# EAGLE design spectrum (EAGLE 7.7.0)
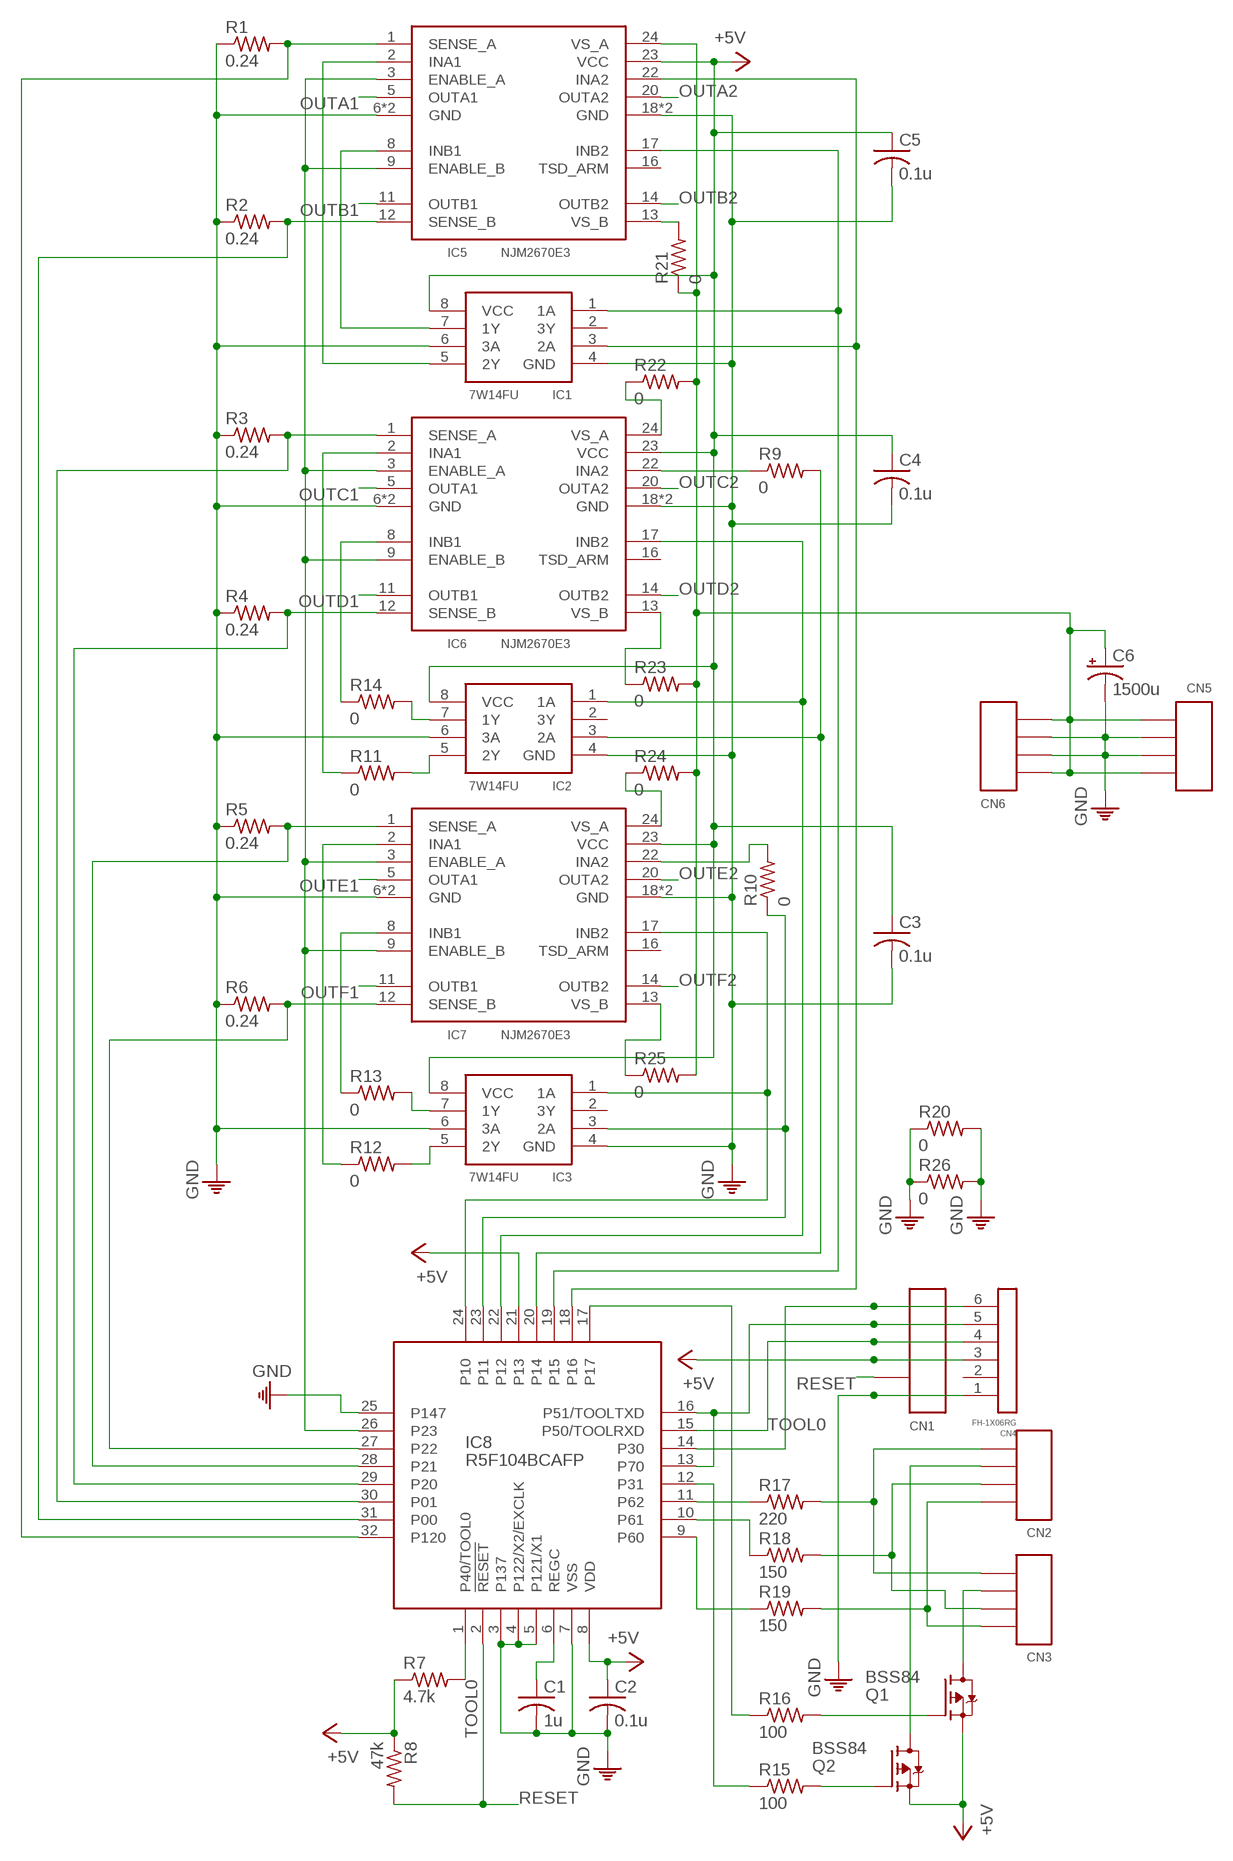
[diagram p0: schematic, sheet 1]

## Parts
C1  1u  C2012  [C2012]
C2  0.1u  C2012  [C2012]
C3  0.1u  C2012  [C2012]
C4  0.1u  C2012  [C2012]
C5  0.1u  C2012  [C2012]
C6  1500u  CCE3.5-8  [E3,5-8]
CN1  PH-1X06RG  [PH-1X06RG]
CN2  PH-1X04SG  [PH-1X04SG]
CN3  PH-1X04SG  [PH-1X04SG]
CN4  FH-1X06RG  [FH-1X06RG]
CN5  PH-1X04SGRG  [PH-1X04RG]
CN6  FH-1X04RG  [FH-1X04RG]
IC1  7W14FU  [SSOP8-P-0.65]
IC2  7W14FU  [SSOP8-P-0.65]
IC3  7W14FU  [SSOP8-P-0.65]
IC5  NJM2670E3  [EMP-24]
IC6  NJM2670E3  [EMP-24]
IC7  NJM2670E3  [EMP-24]
IC8  R5F104BCAFP  [P-LQFP32-7X7-0.80]
Q1  BSS84  [SOT-23F]
Q2  BSS84  [SOT-23F]
R1  0.24  R3225  [R3225]
R2  0.24  R3225  [R3225]
R3  0.24  R3225  [R3225]
R4  0.24  R3225  [R3225]
R5  0.24  R3225  [R3225]
R6  0.24  R3225  [R3225]
R7  4.7k  R2012  [R2012]
R8  47k  R2012  [R2012]
R9  0  R2012  [R2012]
R10  0  R2012  [R2012]
R11  0  R2012  [R2012]
R12  0  R2012  [R2012]
R13  0  R2012  [R2012]
R14  0  R2012  [R2012]
R15  100  R2012  [R2012]
R16  100  R2012  [R2012]
R17  220  R2012  [R2012]
R18  150  R2012  [R2012]
R19  150  R2012  [R2012]
R20  0  R0204/5  [0204/5]
R21  0  R0204/7  [0204/7]
R22  0  R0204/7  [0204/7]
R23  0  R0204/7  [0204/7]
R24  0  R0204/7  [0204/7]
R25  0  R0204/7  [0204/7]
R26  0  R0204/5  [0204/5]

## Nets
+5V: C2.1 C3.1 C4.1 C5.1 CN1.P$4 CN4.3 IC1.8(VCC) IC2.8(VCC) IC3.8(VCC) IC5.23(VCC) IC6.23(VCC) IC7.23(VCC) IC8.8(VDD) IC8.21(P13) Q1.P$2(S) Q2.P$2(S) R7.1 R8.1
GND: C1.2 C2.2 C3.2 C4.2 C5.2 C6.- CN1.P$6 CN4.1 CN5.2 CN5.3 CN6.2 CN6.3 IC1.4(GND) IC1.6(3A) IC2.4(GND) IC2.6(3A) IC3.4(GND) IC3.6(3A) IC5.6(GND) IC5.7(GND) IC5.18(GND) IC5.19(GND) IC6.6(GND) IC6.7(GND) IC6.18(GND) IC6.19(GND) IC7.6(GND) IC7.7(GND) IC7.18(GND) IC7.19(GND) IC8.3(P137) IC8.4(P122/X2/EXCLK) IC8.5(P121/X1) IC8.7(VSS) IC8.25(P147) R1.1 R2.1 R3.1 R4.1 R5.1 R6.1 R20.1 R20.2 R26.1 R26.2
N$1: IC5.1(SENSE_A) IC8.32(P120) R1.2
N$2: IC5.12(SENSE_B) IC8.31(P00) R2.2
N$3: IC1.7(1Y) IC5.8(INB1)
N$4: IC1.1(1A) IC5.17(INB2) IC8.19(P15)
N$5: IC6.1(SENSE_A) IC8.30(P01) R3.2
N$6: IC6.12(SENSE_B) IC8.29(P20) R4.2
N$7: IC6.22(INA2) R9.1
N$8: IC7.12(SENSE_B) IC8.27(P22) R6.2
N$9: IC7.1(SENSE_A) IC8.28(P21) R5.2
N$10: IC5.3(ENABLE_A) IC5.9(ENABLE_B) IC6.3(ENABLE_A) IC6.9(ENABLE_B) IC7.3(ENABLE_A) IC7.9(ENABLE_B) IC8.26(P23)
N$11: IC3.1(1A) IC7.17(INB2) IC8.24(P10)
N$12: IC3.3(2A) IC8.23(P11) R10.1
N$13: C6.+ CN5.1 CN5.4 CN6.1 CN6.4 IC5.24(VS_A) R21.1 R22.2 R23.2 R24.2 R25.2
N$14: IC2.1(1A) IC6.17(INB2) IC8.22(P12)
N$15: IC2.3(2A) IC8.20(P14) R9.2
N$16: IC1.3(2A) IC5.22(INA2) IC8.18(P16)
N$17: IC1.5(2Y) IC5.2(INA1)
N$18: IC7.22(INA2) R10.2
N$19: CN1.P$2 CN4.5 IC8.13(P70) IC8.16(P51/TOOLTXD)
N$20: IC6.8(INB1) R14.1
N$21: IC6.2(INA1) R11.1
N$22: CN1.P$1 CN4.6 IC8.14(P30)
N$23: IC7.8(INB1) R13.1
N$24: IC7.2(INA1) R12.1
N$25: IC2.5(2Y) R11.2
N$26: C1.1 IC8.6(REGC)
N$27: IC3.5(2Y) R12.2
N$28: IC3.7(1Y) R13.2
N$29: IC2.7(1Y) R14.2
N$30: Q2.P$1(G) R15.2
N$31: Q1.P$1(G) R16.2
N$32: IC8.11(P62) R17.1
N$33: CN3.P$2 Q1.P$3(D)
N$34: CN2.P$2 Q2.P$3(D)
N$35: IC8.17 R16.1
N$36: IC8.12(P31) R15.1
N$37: CN2.P$1 CN3.P$1 R17.2
N$38: CN2.P$3 CN3.P$3 R18.2
N$39: CN2.P$4 CN3.P$4 R19.2
N$40: IC8.10(P61) R18.1
N$41: IC8.9(P60) R19.1
N$42: IC5.13(VS_B) R21.2
N$43: IC6.24(VS_A) R22.1
N$45: IC6.13(VS_B) R23.1
N$46: IC7.24(VS_A) R24.1
N$47: IC7.13(VS_B) R25.1
OUTA1: IC5.5(OUTA1)
OUTA2: IC5.20(OUTA2)
OUTB1: IC5.11(OUTB1)
OUTB2: IC5.14(OUTB2)
OUTC1: IC6.5(OUTA1)
OUTC2: IC6.20(OUTA2)
OUTD1: IC6.11(OUTB1)
OUTD2: IC6.14(OUTB2)
OUTE1: IC7.5(OUTA1)
OUTE2: IC7.20(OUTA2)
OUTF1: IC7.11(OUTB1)
OUTF2: IC7.14(OUTB2)
RESET: CN1.P$5 IC8.2(!RESET!) R8.2
TOOL0: CN1.P$3 CN4.4 IC8.1(P40/TOOL0) IC8.15(P50/TOOLRXD) R7.2
Unconnected: CN4.2 IC1.2(3Y) IC2.2(3Y) IC3.2(3Y) IC5.16(TSD_ARM) IC6.16(TSD_ARM) IC7.16(TSD_ARM)

## Library data of the parts
C1-C5 = MyLib:C: CAPACITOR, American symbol
C6 = MyLib:CC: POLARIZED CAPACITOR, American symbol
CN1 = MyLib:PH-1X06
CN2 CN3 CN5 = MyLib:PH-1X04SG
CN4 = MyLib:FH-1X06
CN6 = MyLib:FH-1X04
IC1-IC3 = MyLib:7*14
IC5-IC7 = MyLib:NJM2670
IC8 = MyLib:R5F104B*FP
Q1 Q2 = MyLib:BSS84
R1-R26 = MyLib:R: RESISTOR, American symbol

## Board
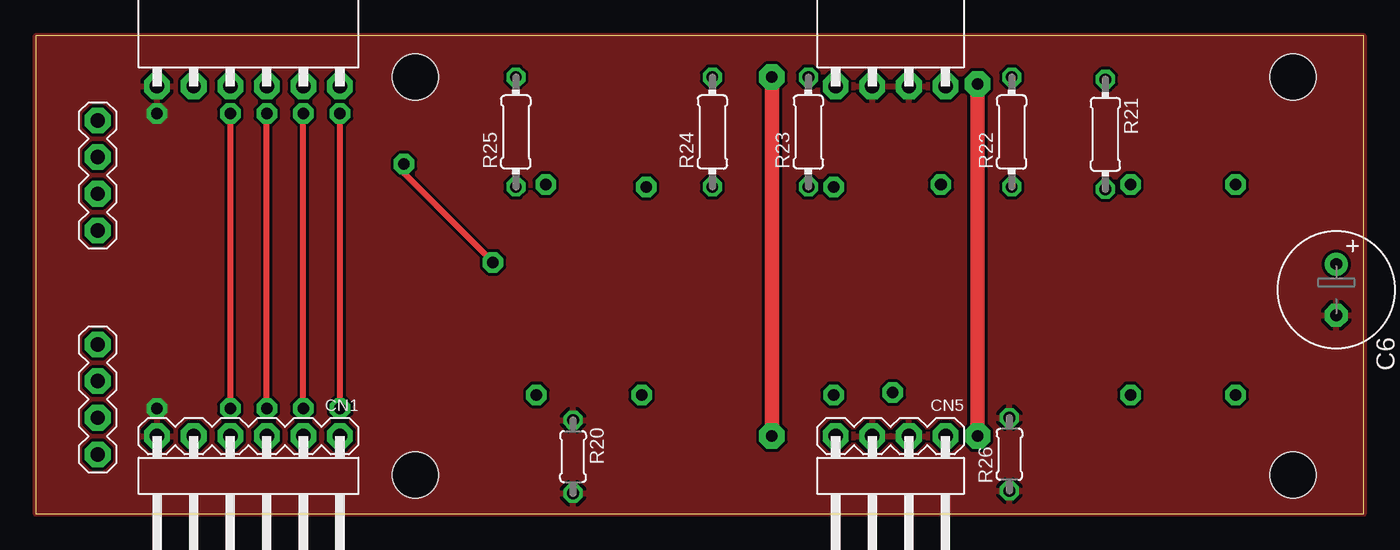
[diagram p1: board, top side]
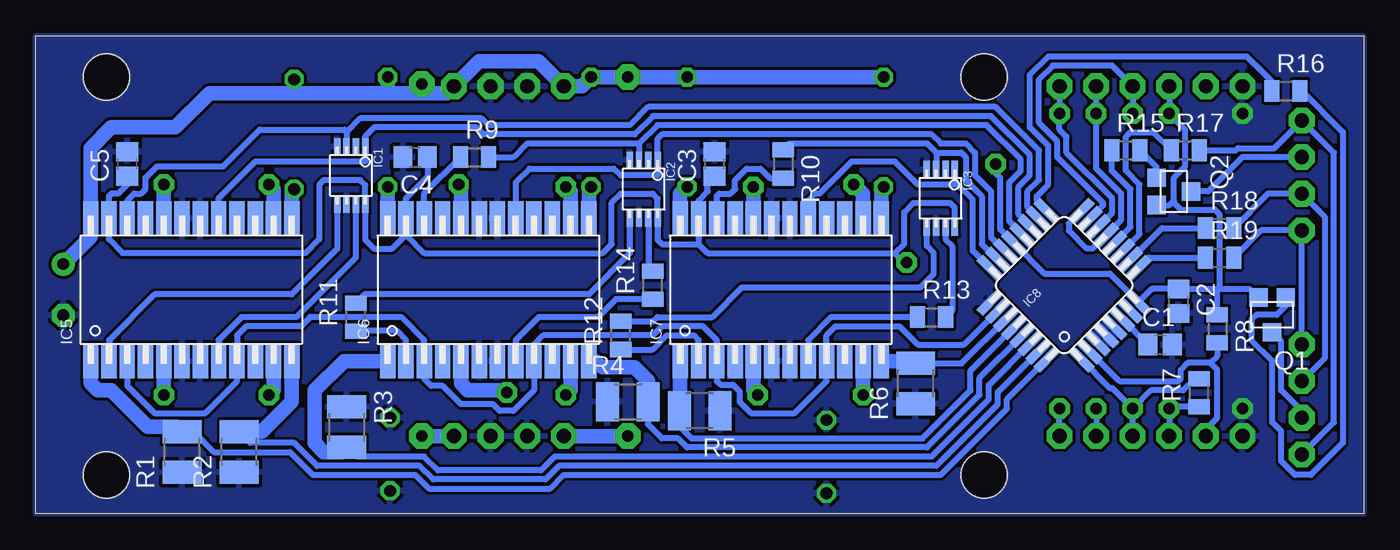
[diagram p2: board, bottom side, seen from below]

Size 92.22 x 33.17 mm. Coordinates in mm from the lower left corner, seen from the top.
Outline: 0,33.17 0,0 92.22,0 92.22,33.17 0,33.17
Copper layers (1*16): Top 0.0356mm / dielectric 1.5011mm / Bottom 0.0356mm
Design rules "formitaminimum *": minimum track width 5mil, minimum drill 0.5994mm, track to track 0.2007mm, track to pad 0.2007mm, pad to pad 0.2007mm, via to via 0.2007mm, smd to smd 0mil, copper to edge 0mil, drill to drill 1mil, minimum pad ring 10mil, minimum via ring 8mil, stop-mask expansion 4mil, vias tented up to drill 0mil, thermal gap 10mil
Holes 3.2 mm at 87.31,30.31 87.31,2.69 26.35,2.69 26.35,30.31

### Footprints (pad centres in the part's own frame; a part is rotated, then mirrored left to right if it is on the bottom)
C2012 = smd 1.3 x 1.5: 1 -0.85,0; 2 0.85,0
E3,5-8 = drill 0.813 pad 1.6: + -1.778,0 | drill 0.813 pad 1.6 octagon: - 1.778,0
PH-1X06RG = drill 1 pad 1.778 octagon: P$1 -6.35,0; P$2 -3.81,0; P$3 -1.27,0; P$4 1.27,0; P$5 3.81,0; P$6 6.35,0
PH-1X04SG = drill 1 pad 1.778 octagon: P$1 -3.81,0; P$2 -1.27,0; P$3 1.27,0; P$4 3.81,0
FH-1X06RG = drill 1 pad 1.778 octagon: 1 -6.35,0; 2 -3.81,0; 3 -1.27,0; 4 1.27,0; 5 3.81,0; 6 6.35,0
PH-1X04RG = drill 1 pad 1.778 octagon: 1 -3.81,0; 2 -1.27,0; 3 1.27,0; 4 3.81,0
FH-1X04RG = drill 1 pad 1.778 octagon: 1 -6.35,0; 2 -3.81,0; 3 -1.27,0; 4 1.27,0
SSOP8-P-0.65 = smd 1.2 x 0.45: 1 -2,0.975; 2 -2,0.325; 3 -2,-0.325; 4 -2,-0.975; 5 2,-0.975; 6 2,-0.325; 7 2,0.325; 8 2,0.975
EMP-24 = smd 2.4 x 1.07: 1 -4.95,6.985; 2 -4.95,5.715; 3 -4.95,4.445; 4 -4.95,3.175; 5 -4.95,1.905; 6 -4.95,0.635; 7 -4.95,-0.635; 8 -4.95,-1.905; 9 -4.95,-3.175; 10 -4.95,-4.445; 11 -4.95,-5.715; 12 -4.95,-6.985; 13 4.95,-6.985; 14 4.95,-5.715; 15 4.95,-4.445; 16 4.95,-3.175; 17 4.95,-1.905; 18 4.95,-0.635; 19 4.95,0.635; 20 4.95,1.905; 21 4.95,3.175; 22 4.95,4.445; 23 4.95,5.715; 24 4.95,6.985
P-LQFP32-7X7-0.80 = smd 0.6 x 2: 1 -2.8,-4.5; 2 -2,-4.5; 3 -1.2,-4.5; 4 -0.4,-4.5; 5 0.4,-4.5; 6 1.2,-4.5; 7 2,-4.5; 8 2.8,-4.5; 17 2.8,4.5; 18 2,4.5; 19 1.2,4.5; 20 0.4,4.5; 21 -0.4,4.5; 22 -1.2,4.5; 23 -2,4.5; 24 -2.8,4.5 | smd 2 x 0.6: 9 4.5,-2.8; 10 4.5,-2; 11 4.5,-1.2; 12 4.5,-0.4; 13 4.5,0.4; 14 4.5,1.2; 15 4.5,2; 16 4.5,2.8; 25 -4.5,2.8; 26 -4.5,2; 27 -4.5,1.2; 28 -4.5,0.4; 29 -4.5,-0.4; 30 -4.5,-1.2; 31 -4.5,-2; 32 -4.5,-2.8
SOT-23F = smd 1.27 x 1.27: P$1 -0.95,-1.2; P$2 0.95,-1.2; P$3 0,1.2
R3225 = smd 1.6 x 2.7: 1 -1.4,0; 2 1.4,0
R2012 = smd 1.046 x 1.5: 1 -0.977,0; 2 0.977,0
0204/5 = drill 0.813 octagon: 1 -2.54,0; 2 2.54,0
0204/7 = drill 0.813 octagon: 1 -3.81,0; 2 3.81,0

### Placement (x,y rotation side)
C1  14.13,11.73 0 bottom
C2  12.86,14.75 270 bottom
C3  45.09,24.28 90 bottom
C4  65.88,24.75 180 bottom
C5  85.88,24.28 90 bottom
C6  90.33,15.54 270 top
CN1  14.76,5.38 180 top
CN2  4.29,23.48 270 top
CN3  4.29,7.92 90 top
CN4  14.76,29.67 0 top
CN5  59.37,5.38 180 top
CN6  61.91,29.67 0 top
IC1  70.33,23.48 270 bottom
IC2  50.01,22.53 270 bottom
IC3  29.37,21.89 270 bottom
IC5  81.44,15.54 90 bottom
IC6  60.8,15.54 90 bottom
IC7  40.48,15.54 90 bottom
IC8  20.8,15.86 45 bottom
Q1  6.35,13.8 180 bottom
Q2  13.18,22.37 270 bottom
R1  82.07,4.27 90 bottom
R2  78.11,4.27 90 bottom
R3  70.64,6.02 270 bottom
R4  51.12,7.77 0 bottom
R5  46.12,7.13 180 bottom
R6  31.12,9.04 90 bottom
R7  11.43,8.4 90 bottom
R8  10.16,12.85 270 bottom
R9  61.75,24.75 0 bottom
R10  40.32,24.28 270 bottom
R11  70.01,13.64 90 bottom
R12  51.59,12.37 90 bottom
R13  30,13.64 0 bottom
R14  49.37,15.86 90 bottom
R15  16.51,25.23 0 bottom
R16  5.4,29.36 0 bottom
R17  12.38,25.23 0 bottom
R18  10,19.83 0 bottom
R19  10,17.77 0 bottom
R20  37.31,3.96 270 top
R21  74.3,26.34 270 top
R22  67.79,26.5 90 top
R23  53.66,26.5 90 top
R24  46.99,26.5 90 top
R25  33.34,26.5 90 top
R26  67.63,4.12 90 top

### Tracks (layer width: path | path; a pad name or v marks a point on that pad's centre or on a via)
+5V  (via drill 0.8 pad 1.42)
  Top 0.406: v13.49,27.77 v13.49,7.29 | v25.56,24.28 25.56,23.64 v31.75,17.45
  Bottom 0.406: 66.52,19.36 IC6.23 66.52,21.89 65.03,23.38 C4.1 | 46.2,18.72 IC7.23 46.2,21.74 45.56,22.37 45.56,22.95 C3.1 | 46.2,18.72 45.56,18.09 32.54,18.09 | 32.54,18.09 31.91,18.72 31.91,20.94 31.27,21.58 28.73,21.58 28.39,21.24 IC3.8 | 66.52,19.36 67.47,18.4 68.74,18.4 69.35,19.02 IC1.8 69.35,22.82 69.69,23.16 72.23,23.16 72.55,22.85 72.55,19.04 73.5,18.09 86.2,18.09 87.15,19.04 IC5.23 87.15,22.05 86.99,22.21 86.52,22.21 85.88,22.85 C5.1 | 66.52,19.36 65.25,18.09 52.86,18.09 52.23,18.72 52.23,21.58 51.59,22.21 49.37,22.21 49.03,21.87 IC2.8 49.03,19.02 48.74,18.72 46.2,18.72 | v25.56,24.28 25.56,23.64 25.24,23.32 25.24,19.74 IC8.21 22.16,16.66 17.63,16.66 IC8.8 14.69,15.6 C2.1 10.16,15.6 | v31.75,17.45 31.91,17.45 32.54,18.09 | CN4.3 v13.49,27.77 12.38,26.66 12.38,24.12 13.18,23.32 13.18,21.74 | CN1.P$4 v13.49,7.29 13.36,7.42 R7.1 | 10.16,15.6 10,15.6 | 10,15.6 7.9,15.6 Q1.P$2 | 13.18,21.74 13.18,21.58 12.7,21.1 10.32,21.1 10,20.78 10,15.6 | Q2.P$2 13.49,21.42 13.18,21.74 | R8.1 10.16,15.6
GND  (via drill 0.8 pad 1.42)
  other vias: 8.41,7.29 8.41,27.77
  pour Bottom: 0,33.17 0,-0.01 92.23,-0.01 92.23,33.17
  pour Top: 0,33.17 92.23,33.17 92.23,-0.01 0,-0.01
N$1
  Bottom 0.406: IC8.32 24.76,7.93 24.76,7.29 29.37,2.69 55.56,2.69 56.51,1.73 64.93,1.73 65.88,2.69 73,2.69 74.58,4.27 79.85,4.27 81.25,5.67 R1.2
  Bottom 1.016: IC5.1 88.42,9.04 87.95,8.56 86.99,8.56 84.45,6.02 82.42,6.02 R1.2
N$2
  Bottom 0.406: IC8.31 25.4,8.43 25.4,7.61 29.69,3.32 55.88,3.32 56.83,2.37 64.61,2.37 65.56,3.32 72.71,3.32 74.29,4.91 77.34,4.91 R2.2
  Bottom 1.016: IC5.12 74.45,7.77 76.55,5.67 R2.2
N$3
  Bottom 0.406: IC1.7 70,17.77 74.14,13.64 77.95,13.64 79.53,12.05 IC5.8
N$4
  Bottom 0.406: IC8.19 23.13,19.94 23.97,20.78 23.97,22.69 23.18,23.48 23.18,24.91 25.88,27.61 49.37,27.61 50.64,26.34 61.12,26.34 61.59,26.82 68.74,26.82 69.35,26.2 IC1.1 69.35,24.46 69.37,24.43 76.99,24.43 79.53,21.89 IC5.17
N$5
  Bottom 0.406: IC8.30 26.03,8.93 26.03,7.92 30,3.96 56.2,3.96 57.15,3 64.29,3 65.25,3.96 69.98,3.96 R3.2
  Bottom 1.016: IC6.1 70.83,10.59 72.87,8.56 72.87,4.91 72.23,4.27 70.99,4.27 R3.2
N$6
  Bottom 0.406: IC8.29 26.67,9.42 26.67,8.24 30.32,4.59 46.99,4.59 47.62,5.23 48.74,5.23 49.72,6.21 R4.2
  Bottom 1.016: IC6.12 53.31,10.59 52.86,10.15 50.64,10.15 49.72,9.22 R4.2
N$7
  Bottom 0.406: IC6.22 65.25,22.24 R9.1
N$8
  Bottom 0.406: R6.2 27.92,10.44 IC8.27
  Bottom 1.016: IC7.12 31.27,10.59 R6.2
N$9
  Bottom 0.406: IC8.28 27.3,9.92 27.3,8.56 30.64,5.23 46.67,5.23 47.52,6.07 R5.2
  Bottom 1.016: IC7.1 47.47,7.18 R5.2
N$10
  Bottom 0.406: IC5.3 85.88,8.88 83.98,6.97 80.49,6.97 78.26,9.2 IC5.9 78.26,12.37 77.63,13 73.82,13 73.18,13.64 66.83,13.64 65.25,12.05 IC6.3 65.25,9.35 64.77,8.88 63.98,8.88 62.71,7.61 60.48,7.61 60.01,7.13 59.05,7.13 57.63,8.56 IC6.9 57.63,11.73 56.99,12.37 49.37,12.37 48.74,13 45.88,13 44.93,12.05 IC7.3 44.93,9.2 44.69,8.96 43.81,8.96 43.34,8.48 43.34,7.77 42.54,6.97 39.53,6.97 37.31,9.2 IC7.9 37.31,12.37 36.67,13 32.23,13 30.96,11.73 27.75,11.73 IC8.26
N$11
  Bottom 0.406: IC3.1 28.39,22.87 | 28.39,22.87 28.42,22.85 30.96,22.85 32.54,24.43 35.56,24.43 37.78,22.21 38.1,22.21 38.58,21.74 IC7.17 | 28.39,22.87 28.23,22.87 27.15,21.78 27.15,18.24 IC8.24
N$12
  Bottom 0.406: 29.69,25.07 29.69,23.9 IC3.3 | 29.69,25.07 30.32,25.7 39.87,25.7 R10.1 | 29.69,25.07 27.94,25.07 27.62,24.75 27.62,23.16 26.51,22.05 26.51,18.72 25.42,17.63 IC8.23
N$13  (via drill 0.8 pad 1.78)
  Top 1.016: v51.12,5.39 v51.12,30.31 | v65.4,5.39 v65.4,29.83
  Bottom 1.016: 74.29,29.2 80.17,29.2 82.55,26.82 86.99,26.82 88.42,25.39 IC5.24 88.42,19.23 C6.+ | 74.29,29.2 67.63,29.2 | 67.63,29.2 65.4,29.2 | 65.4,29.2 63.66,29.2 CN6.4 61.44,31.42 57.31,31.42 CN6.1 54.29,29.67 R23.2 v51.12,30.31 R24.2 R25.2 | R21.1 74.29,29.2 | R22.2 67.79,29.36 67.63,29.2 | CN5.4 v51.12,5.39 | CN5.1 v65.4,5.39 | v65.4,29.83 65.4,29.2
N$14
  Bottom 0.406: IC6.17 58.9,23.01 57.94,23.96 52.07,23.96 51.59,23.48 49.05,23.48 49.03,23.5 IC2.1 49.03,26.04 48.74,26.34 30,26.34 29.37,25.7 27.62,25.7 26.99,25.07 26.99,23.48 25.88,22.37 25.88,19.2 24.88,18.2 IC8.22
N$15
  Bottom 0.406: 50.32,25.7 49.05,26.97 26.19,26.97 23.81,24.59 23.81,23.8 24.61,23.01 24.61,20.31 23.7,19.4 IC8.20 | R9.2 59.05,24.75 58.1,25.7 50.32,25.7 | 50.32,25.7 IC2.3
N$16
  Bottom 0.406: 70.64,26.5 69.69,27.45 61.28,27.45 60.8,26.97 50.96,26.97 49.69,28.25 25.56,28.25 22.54,25.23 22.54,23.16 23.34,22.37 23.34,21.26 22.56,20.49 IC8.18 | 70.64,26.5 IC1.3 | 70.64,26.5 70.8,26.66 76.68,26.66 79.22,24.12 83.82,24.12 84.61,23.32 84.61,22.53 84.93,22.21 85.41,22.21 85.88,21.74 IC5.22
N$17
  Bottom 0.406: IC1.5 71.3,18.38 74.45,15.23 83.98,15.23 87.15,12.05 IC5.2
N$18
  Bottom 0.406: IC7.22 44.93,22.05 44.77,22.21 43.97,22.21 43.66,22.53 43.66,23.16 42.86,23.96 41.91,23.96 41.25,23.3 R10.2
N$19  (via drill 0.8 pad 1.42)
  Top 0.406: v18.57,7.29 v18.57,27.77
  Bottom 0.406: IC8.16 20.48,20.14 20.48,19.67 19.21,18.4 18.82,18.4 IC8.13 16.83,20.4 16.83,22.21 18.57,23.96 v18.57,27.77 CN4.5 | v18.57,7.29 CN1.P$2
N$20
  Bottom 0.406: IC6.8 58.9,12.05 57.31,13.64 53.18,13.64 51.94,14.89 R14.1
N$21
  Bottom 0.406: IC6.2 66.52,12.05 67.15,12.69 69.98,12.69 R11.1
N$22  (via drill 0.8 pad 1.42)
  Top 0.406: v21.11,7.29 v21.11,27.77
  Bottom 0.406: CN1.P$1 v21.11,7.29 | CN4.6 v21.11,27.77 21.11,26.66 20.64,26.18 20.64,25.07 17.46,21.89 17.46,20.89 IC8.14
N$23
  Bottom 0.406: IC7.8 38.58,12.05 36.99,13.64 R13.1
N$24
  Bottom 0.406: IC7.2 46.2,12.05 46.51,12.37 48.42,12.37 49.4,11.39 R12.1
N$25
  Bottom 0.406: IC2.5 50.98,18.06 53.82,15.23 69.4,15.23 R11.2
N$26
  Bottom 0.406: IC8.6 C1.1
N$27
  Bottom 0.406: R12.2 49.35,13.35 49.05,13.64 45.24,13.64 43.18,15.7 30.8,15.7 29.84,16.66 29.84,18.09 30.34,18.58 IC3.5
N$28
  Bottom 0.406: IC3.7 29.04,19.03 28.57,18.56 28.57,14.09 R13.2
N$29
  Bottom 0.406: IC2.7 49.68,17.15 R14.2
N$30
  Bottom 0.406: Q2.P$1 14.38,24.07 R15.2
N$31
  Bottom 0.406: R16.2 4.29,29.36 1.43,26.5 1.43,4.91 3.65,2.69 4.76,2.69 5.71,3.64 5.71,5.7 6.35,6.34 6.35,10.62 7.78,12.05 7.78,13.48 7.46,13.8 6.03,13.8 5.4,14.43 Q1.P$1
N$32
  Bottom 0.406: IC8.11 15.56,19.4 15.56,22.85 16.51,23.8 16.51,26.18 16.19,26.5 14.63,26.5 R17.1
N$33
  Bottom 0.406: CN3.P$2 4.29,7.13 5.71,8.56 5.71,11.96 Q1.P$3
N$34
  Bottom 0.406: CN2.P$2 8.41,24.75 10.79,22.37 Q2.P$3
N$35
  Bottom 0.406: IC8.17 22.7,21.73 22.7,22.05 21.91,22.85 21.91,25.55 23.18,26.82 23.18,30.47 21.91,31.74 8.1,31.74 7.54,31.18 7.46,31.1 6.37,30.02 R16.1
N$36
  Bottom 0.406: IC8.12 16.19,19.9 16.19,22.53 17.49,23.82 R15.1
N$37
  Bottom 0.406: CN3.P$1 2.06,6.34 2.06,25.07 CN2.P$1 6.19,25.39 8.73,25.39 8.89,25.23 R17.2
N$38
  Bottom 0.406: CN3.P$3 2.7,10.78 2.7,20.63 CN2.P$3 6.64,22.21 R18.2
N$39
  Bottom 0.406: CN3.P$4 CN2.P$4 7.12,19.67 R19.2
N$40
  Bottom 0.406: IC8.10 14,19.83 R18.1
N$41
  Bottom 0.406: IC8.9 14.93,17.77 R19.1
N$42
  Bottom 1.016: IC5.13 74.45,22.37 R21.2
N$43
  Bottom 1.016: IC6.24 R22.1
N$45
  Bottom 1.016: IC6.13 53.82,22.53 R23.1
N$46
  Bottom 1.016: IC7.24 47.47,22.21 R24.1
N$47
  Bottom 1.016: IC7.13 33.5,22.53 R25.1
OUTA1  (via drill 0.8 pad 1.42)
  Bottom 1.016: IC5.5 v83.34,8.24
OUTA2  (via drill 0.8 pad 1.42)
  Bottom 1.016: v83.34,22.85 IC5.20
OUTB1  (via drill 0.8 pad 1.42)
  Bottom 1.016: IC5.11 75.72,8.56 v76.04,8.24
OUTB2  (via drill 0.8 pad 1.42)
  Bottom 1.016: IC5.14 75.72,22.53 v76.04,22.85
OUTC1  (via drill 0.8 pad 1.42)
  Bottom 1.016: IC6.5 62.71,9.04 62.23,8.56 59.69,8.56 v59.53,8.4
OUTC2  (via drill 0.8 pad 1.42)
  Bottom 1.016: IC6.20 62.71,22.69 v62.86,22.85
OUTD1  (via drill 0.8 pad 1.42)
  Bottom 1.016: IC6.11 55.09,8.56 v55.4,8.24
OUTD2  (via drill 0.8 pad 1.42)
  Bottom 1.016: IC6.14 55.09,22.37 v55.4,22.69
OUTE1  (via drill 0.8 pad 1.42)
  Bottom 1.016: IC7.5 42.39,8.56 v42.07,8.24
OUTE2  (via drill 0.8 pad 1.42)
  Bottom 1.016: v42.39,22.69 IC7.20
OUTF1  (via drill 0.8 pad 1.42)
  Bottom 1.016: IC7.11 v34.77,8.24
OUTF2  (via drill 0.8 pad 1.42)
  Bottom 1.016: IC7.14 34.77,22.21 v35.4,22.85
RESET
  Bottom 0.406: IC8.2 16.96,9.2 12.86,9.2 12.7,9.35 12.7,9.99 12.22,10.47 10.64,10.47 | CN1.P$5 10.95,5.86 10.16,6.65 10.16,9.99 10.64,10.47 | R8.2 10.16,10.94 10.64,10.47
TOOL0  (via drill 0.8 pad 1.42)
  Top 0.406: v16.03,7.29 v16.03,27.77
  Bottom 0.406: IC8.1 17.61,8.72 17.46,8.72 v16.03,7.29 | v16.03,27.77 CN4.4 17.46,31.1 21.59,31.1 22.54,30.15 22.54,27.13 21.27,25.86 21.27,24.75 18.1,21.58 18.1,21.39 IC8.15 | CN1.P$3 v16.03,7.29 | R7.2 11.72,9.38 12.54,8.56 14.76,8.56 v16.03,7.29